# Altium schematic sheet Jumpers_rev2.SchDoc
size B
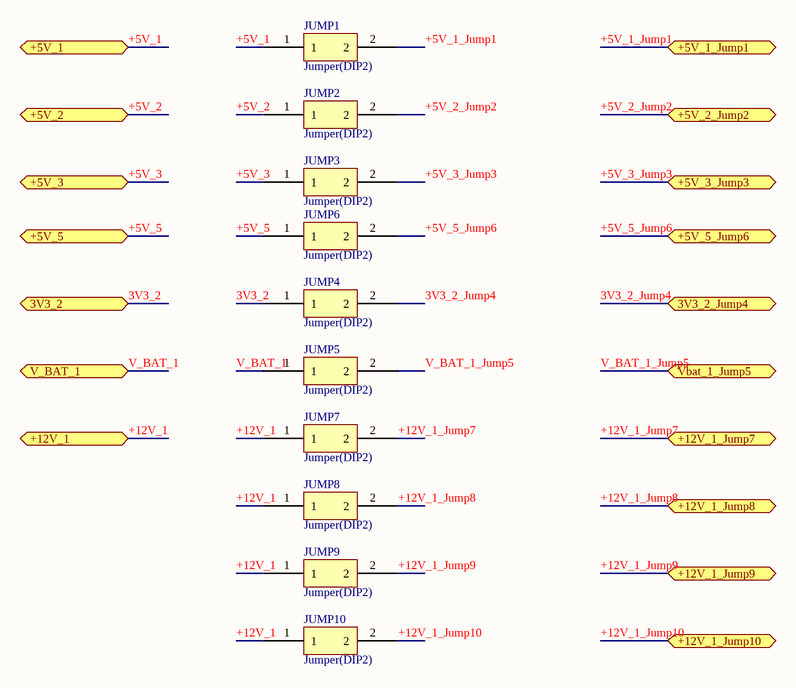
[diagram p0: Jumpers_rev2.SchDoc]

## Parts
JUMP1  Jumper(DIP2)  [Jumper(DIP2)]
JUMP2  Jumper(DIP2)  [Jumper(DIP2)]
JUMP3  Jumper(DIP2)  [Jumper(DIP2)]
JUMP4  Jumper(DIP2)  [Jumper(DIP2)]
JUMP5  Jumper(DIP2)  [Jumper(DIP2)]
JUMP6  Jumper(DIP2)  [Jumper(DIP2)]
JUMP7  Jumper(DIP2)  [Jumper(DIP2)]
JUMP8  Jumper(DIP2)  [Jumper(DIP2)]
JUMP9  Jumper(DIP2)  [Jumper(DIP2)]
JUMP10  Jumper(DIP2)  [Jumper(DIP2)]

## Ports
3V3_2 (bidir), 3V3_2_Jump4 (bidir), +5V_1 (bidir), +5V_1_Jump1 (bidir), +5V_2 (bidir), +5V_2_Jump2 (bidir), +5V_3 (bidir), +5V_3_Jump3 (bidir), +5V_5 (bidir), +5V_5_Jump6 (bidir), +12V_1 (bidir), +12V_1_Jump7 (bidir), +12V_1_Jump8 (bidir), +12V_1_Jump9 (bidir), +12V_1_Jump10 (bidir), V_BAT_1 (bidir), Vbat_1_Jump5 (bidir)

## Nets
3V3_2: JUMP4.1 ; port 3V3_2
3V3_2_Jump4: JUMP4.2 ; port 3V3_2_Jump4
+5V_1: JUMP1.1 ; port +5V_1
+5V_1_Jump1: JUMP1.2 ; port +5V_1_Jump1
+5V_2: JUMP2.1 ; port +5V_2
+5V_2_Jump2: JUMP2.2 ; port +5V_2_Jump2
+5V_3: JUMP3.1 ; port +5V_3
+5V_3_Jump3: JUMP3.2 ; port +5V_3_Jump3
+5V_5: JUMP6.1 ; port +5V_5
+5V_5_Jump6: JUMP6.2 ; port +5V_5_Jump6
+12V_1: JUMP7.1 JUMP8.1 JUMP9.1 JUMP10.1 ; port +12V_1
+12V_1_Jump7: JUMP7.2 ; port +12V_1_Jump7
+12V_1_Jump8: JUMP8.2 ; port +12V_1_Jump8
+12V_1_Jump9: JUMP9.2 ; port +12V_1_Jump9
+12V_1_Jump10: JUMP10.2 ; port +12V_1_Jump10
V_BAT_1: JUMP5.1 ; port V_BAT_1
V_BAT_1_Jump5: JUMP5.2 ; port Vbat_1_Jump5